# Altium schematic sheet POWER.SchDoc
size A3
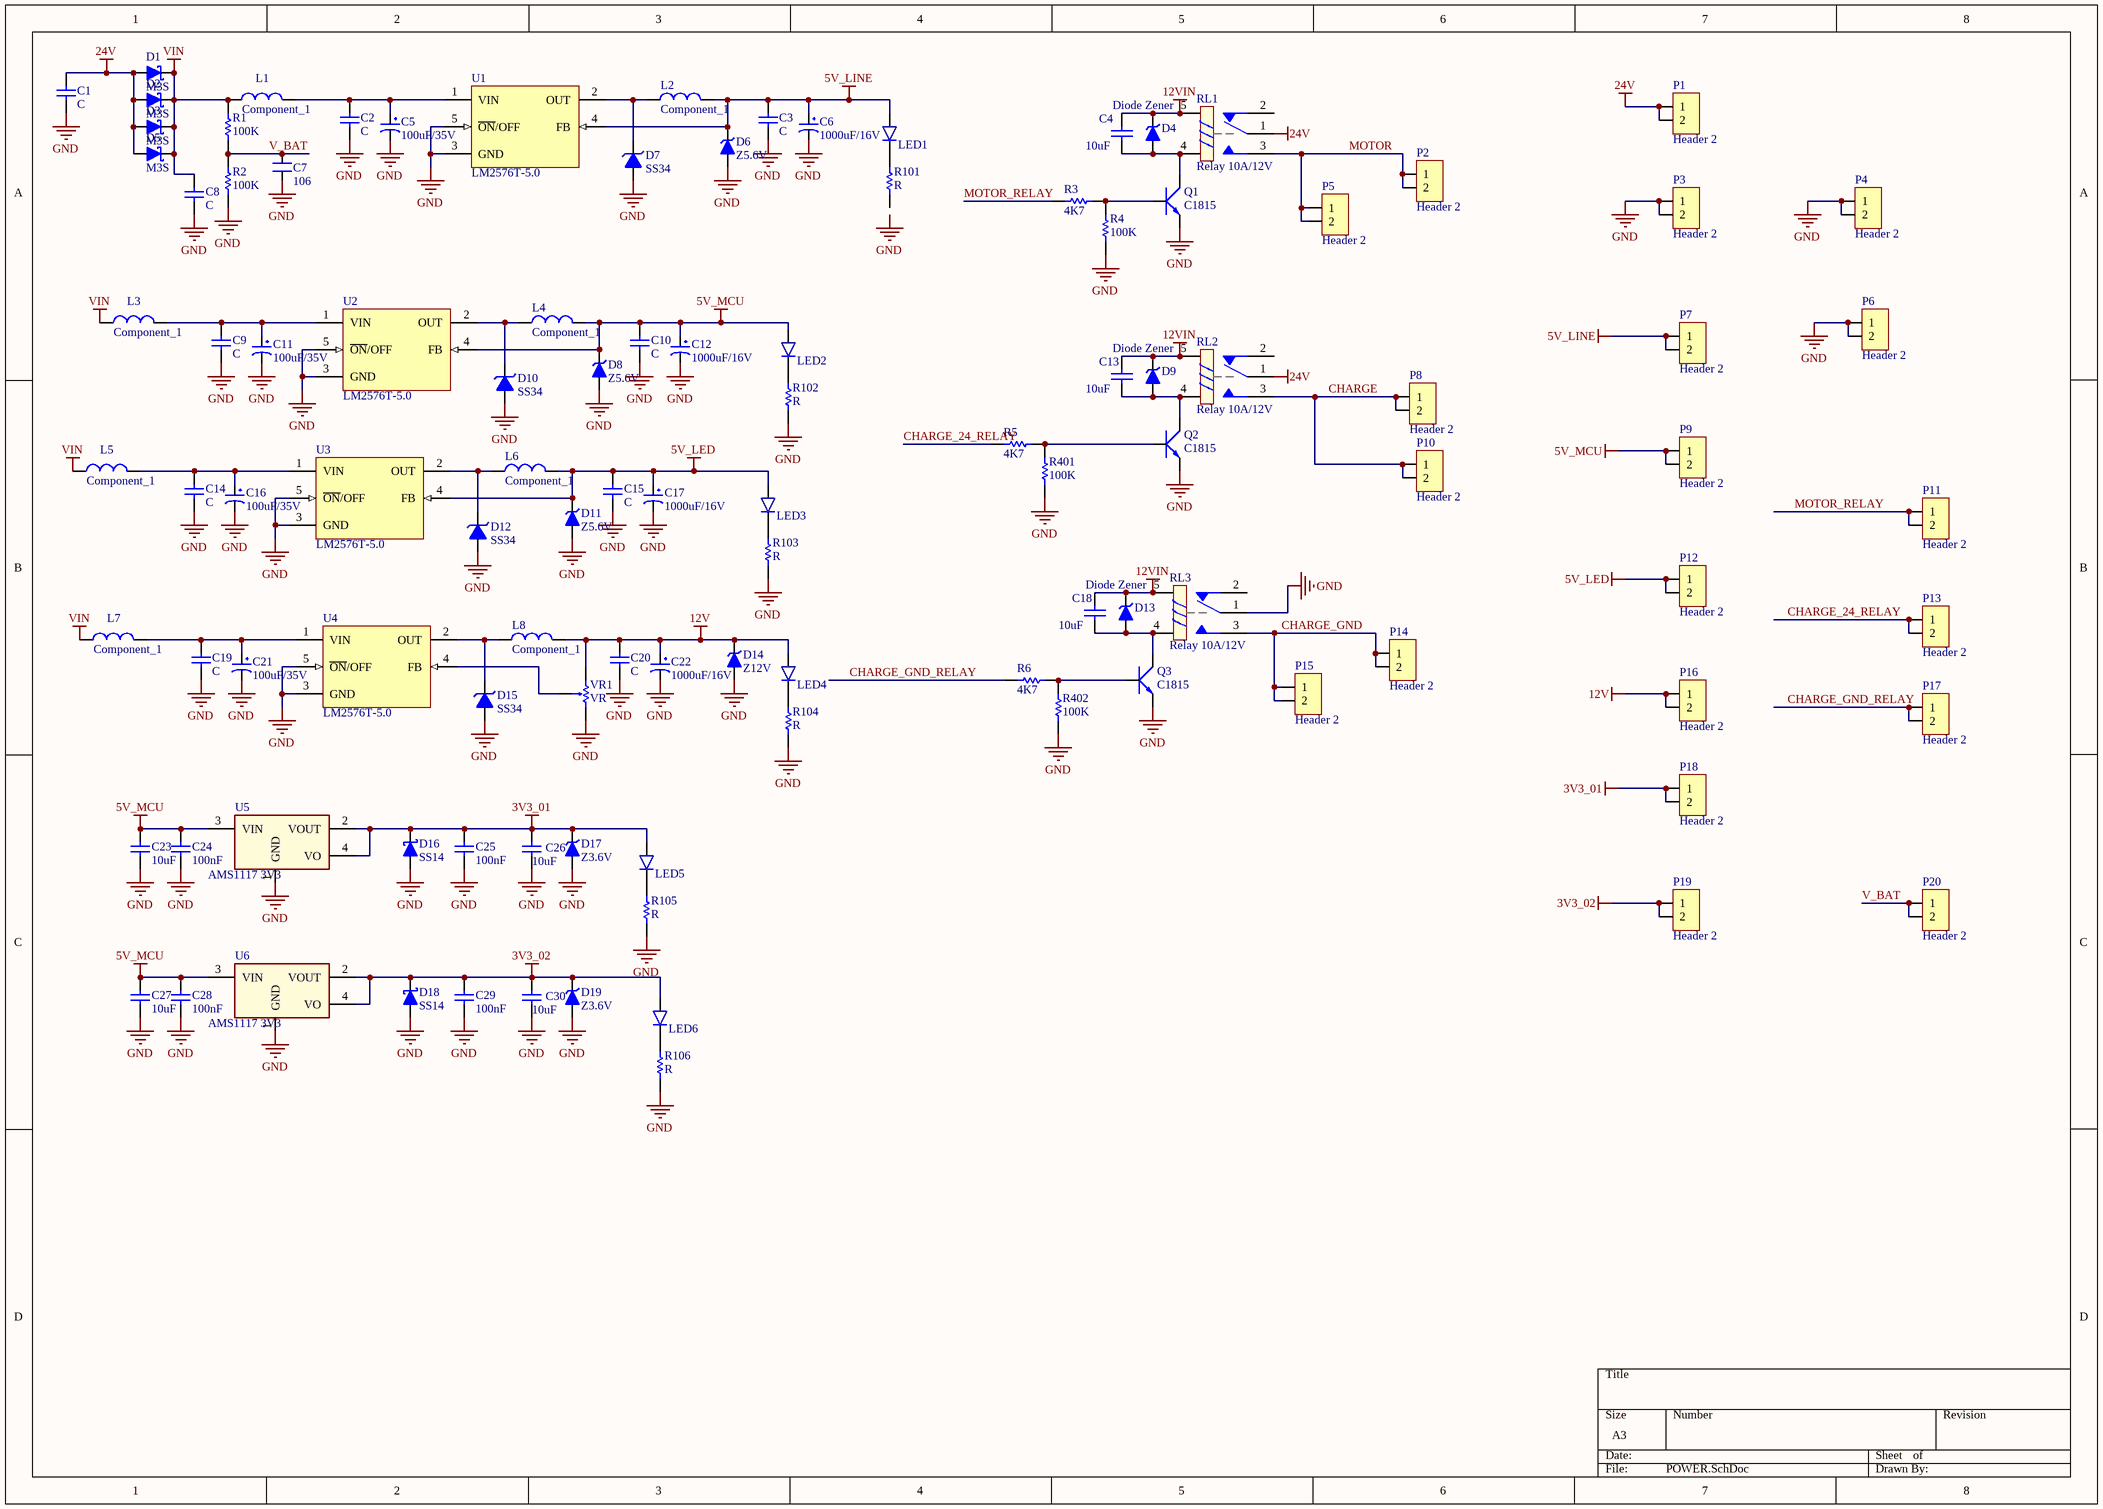
[diagram p0: POWER.SchDoc]

## Parts
C1  C  [VARISTOR DISC 5MM/7MM]
C2  C  [C 104]
C3  C  [C 0805 (2012)]
C4  value 10uF  [C 0805 (2012)]  (hidden comment: Cap Non-pol)
C5  100uF/35V  [WCAP-PSHP 8x8.7x3.1]
C6  1000uF/16V  [WCAP-PSHP 8x8.7x3.1]
C7  106  [R 0805 (2012)]
C8  C  [C 104]
C9  C  [C 104]
C10  C  [C 0805 (2012)]
C11  100uF/35V  [WCAP-PSHP 8x8.7x3.1]
C12  1000uF/16V  [WCAP-PSHP 8x8.7x3.1]
C13  value 10uF  [C 0805 (2012)]  (hidden comment: Cap Non-pol)
C14  C  [C 104]
C15  C  [C 0805 (2012)]
C16  100uF/35V  [WCAP-PSHP 8x8.7x3.1]
C17  1000uF/16V  [WCAP-PSHP 8x8.7x3.1]
C18  value 10uF  [C 0805 (2012)]  (hidden comment: Cap Non-pol)
C19  C  [C 104]
C20  C  [C 0805 (2012)]
C21  100uF/35V  [WCAP-PSHP 8x8.7x3.1]
C22  1000uF/16V  [WCAP-PSHP 8x8.7x3.1]
C23  10uF  [C 0805 (2012)]
C24  100nF  [C 0805 (2012)]
C25  100nF  [C 0805 (2012)]
C26  10uF  [C 0805 (2012)]
C27  10uF  [C 0805 (2012)]
C28  100nF  [C 0805 (2012)]
C29  100nF  [C 0805 (2012)]
C30  10uF  [C 0805 (2012)]
D1  M3S  [DO-214AC (SMA)]
D2  M3S  [DO-214AC (SMA)]
D3  M3S  [DO-214AC (SMA)]
D4  Diode Zener  [SOD-80]
D5  M3S  [DO-214AC (SMA)]
D6  Z5.6V  [SOD-80]
D7  SS34  [DO-214AC (SMA) L]
D8  Z5.6V  [SOD-80]
D9  Diode Zener  [SOD-80]
D10  SS34  [DO-214AC (SMA) L]
D11  Z5.6V  [SOD-80]
D12  SS34  [DO-214AC (SMA) L]
D13  Diode Zener  [SOD-80]
D14  Z12V  [SOD-80]
D15  SS34  [DO-214AC (SMA) L]
D16  SS14  [DO-214AC (SMA)]
D17  Z3.6V  [SOD-80]
D18  SS14  [DO-214AC (SMA)]
D19  Z3.6V  [SOD-80]
L1  Component_1  [1210]
L2  Component_1  [1210]
L3  Component_1  [1210]
L4  Component_1  [1210]
L5  Component_1  [1210]
L6  Component_1  [1210]
L7  Component_1  [1210]
L8  Component_1  [1210]
LED1  Led  [Led SMD 0805]  (value not drawn)
LED2  Led  [Led SMD 0805]  (value not drawn)
LED3  Led  [Led SMD 0805]  (value not drawn)
LED4  Led  [Led SMD 0805]  (value not drawn)
LED5  Led  [Led SMD 0805]  (value not drawn)
LED6  Led  [Led SMD 0805]  (value not drawn)
P1  Header 2  [HDR Domino 2]
P2  Header 2  [HDR Domino 2]
P3  Header 2  [HDR Domino 2]
P4  Header 2  [HDR Domino 2]
P5  Header 2  [HDR Domino 2]
P6  Header 2  [HDR Domino 2]
P7  Header 2  [HDR Domino 2]
P8  Header 2  [HDR Domino 2]
P9  Header 2  [HDR Domino 2]
P10  Header 2  [HDR Domino 2]
P11  Header 2  [HDR Domino 2]
P12  Header 2  [HDR Domino 2]
P13  Header 2  [HDR Domino 2]
P14  Header 2  [HDR Domino 2]
P15  Header 2  [HDR Domino 2]
P16  Header 2  [HDR Domino 2]
P17  Header 2  [HDR Domino 2]
P18  Header 2  [HDR Domino 2]
P19  Header 2  [HDR Domino 2]
P20  Header 2  [HDR Domino 2]
Q1  C1815  [SOT23B]
Q2  C1815  [SOT23B]
Q3  C1815  [SOT23B]
R1  100K  [R 0805 (2012)]
R2  100K  [R 0805 (2012)]
R3  4K7  [R 0805 (2012)]
R4  100K  [R 0805 (2012)]
R5  4K7  [R 0805 (2012)]
R6  4K7  [R 0805 (2012)]
R101  R  [R 0805 (2012)]
R102  R  [R 0805 (2012)]
R103  R  [R 0805 (2012)]
R104  R  [R 0805 (2012)]
R105  R  [R 0805 (2012)]
R106  R  [R 0805 (2012)]
R401  100K  [R 0805 (2012)]
R402  100K  [R 0805 (2012)]
RL1  Relay 10A/12V  [RL_SPDT_10A]
RL2  Relay 10A/12V  [RL_SPDT_10A]
RL3  Relay 10A/12V  [RL_SPDT_10A]
U1  LM2576T-5.0  [D2-PACK5]
U2  LM2576T-5.0  [D2-PACK5]
U3  LM2576T-5.0  [D2-PACK5]
U4  LM2576T-5.0  [D2-PACK5]
U5  AMS1117 3V3  [SOT-223]
U6  AMS1117 3V3  [SOT-223]
VR1  VR  [R VAR E]

## Nets
3V3_01: C25.1 C26.1 D16.2(K) D17.2(K) LED5.1(A) P18.1 P18.2 U5.2(VOUT) U5.4(VO)
3V3_02: C29.1 C30.1 D18.2(K) D19.2(K) LED6.1(A) P19.1 P19.2 U6.2(VOUT) U6.4(VO)
5V_LED: C15.1 C17.1 D11.2(K) L6.2 LED3.1(A) P12.1 P12.2 U3.4(FB)
5V_LINE: C3.1 C6.1 D6.2(K) L2.2 LED1.1(A) P7.1 P7.2 U1.4(FB)
5V_MCU: C10.1 C12.1 C23.1 C24.1 C27.1 C28.1 D8.2(K) L4.2 LED2.1(A) P9.1 P9.2 U2.4(FB) U5.3(VIN) U6.3(VIN)
12V: C20.1 C22.1 D14.2(K) L8.2 LED4.1(A) P16.1 P16.2 VR1.3
12VIN: C4.2 C13.2 C18.2 D4.2(K) D9.2(K) D13.2(K) RL1.5 RL2.5 RL3.5
24V: C1.1 D1.1(A) D2.1(A) D3.1(A) D5.1(A) P1.1 P1.2 RL1.1 RL2.1
GND: C1.2 C2.2 C3.2 C5.2 C6.2 C7.1 C8.2 C9.2 C10.2 C11.2 C12.2 C14.2 C15.2 C16.2 C17.2 C19.2 C20.2 C21.2 C22.2 C23.2 C24.2 C25.2 C26.2 C27.2 C28.2 C29.2 C30.2 D6.1(A) D7.1(A) D8.1(A) D10.1(A) D11.1(A) D12.1(A) D14.1(A) D15.1(A) D16.1(A) D17.1(A) D18.1(A) D19.1(A) P3.1 P3.2 P4.1 P4.2 P6.1 P6.2 Q1.1(E) Q2.1(E) Q3.1(E) R2.2 R4.1 R102.1 R103.1 R104.1 R105.1 R106.1 R401.1 R402.1 RL3.1 U1.3(GND) U1.5(~{ON}/OFF) U2.3(GND) U2.5(~{ON}/OFF) U3.3(GND) U3.5(~{ON}/OFF) U4.3(GND) U4.5(~{ON}/OFF) U5.1(GND) U6.1(GND) VR1.1
VIN: C8.1 D1.2(K) D2.2(K) D3.2(K) D5.2(K) L1.1 L3.1 L5.1 L7.1 R1.1
CHARGE: P8.1 P8.2 P10.1 P10.2 RL2.3
CHARGE_24_RELAY: P13.1 P13.2 R5.1
CHARGE_GND: P14.1 P14.2 P15.1 P15.2 RL3.3
CHARGE_GND_RELAY: P17.1 P17.2 R6.1
MOTOR: P2.1 P2.2 P5.1 P5.2 RL1.3
MOTOR_RELAY: P11.1 P11.2 R3.1
V_BAT: C7.2 P20.1 P20.2 R1.2 R2.1
NetC2_1: C2.1 C5.1 L1.2 U1.1(VIN)
NetC4_1: C4.1 D4.1(A) Q1.2(C) RL1.4
NetC9_1: C9.1 C11.1 L3.2 U2.1(VIN)
NetC13_1: C13.1 D9.1(A) Q2.2(C) RL2.4
NetC14_1: C14.1 C16.1 L5.2 U3.1(VIN)
NetC18_1: C18.1 D13.1(A) Q3.2(C) RL3.4
NetC19_1: C19.1 C21.1 L7.2 U4.1(VIN)
NetD7_2: D7.2(K) L2.1 U1.2(OUT)
NetD10_2: D10.2(K) L4.1 U2.2(OUT)
NetD12_2: D12.2(K) L6.1 U3.2(OUT)
NetD15_2: D15.2(K) L8.1 U4.2(OUT)
NetLED1_2: LED1.2(K) R101.2
NetLED2_2: LED2.2(K) R102.2
NetLED3_2: LED3.2(K) R103.2
NetLED4_2: LED4.2(K) R104.2
NetLED5_2: LED5.2(K) R105.2
NetLED6_2: LED6.2(K) R106.2
NetQ1_3: Q1.3(B) R3.2 R4.2
NetQ2_3: Q2.3(B) R5.2 R401.2
NetQ3_3: Q3.3(B) R6.2 R402.2
NetU4_4: U4.4(FB) VR1.2

Not connected (* = marked no-connect by the designer): R101 1; RL1 2; RL2 2; RL3 2

## Notes on the sheet
- Labels drawn without touching a wire or pin: GND

## Library data of the parts
C1-C3 C8-C10 C14 C15 C19 C20 C23-C30 = Capacitor NP: Capacitor non-pol
C4 C13 C18 = Cap Non-pol: Non-polarized Capacitor; Published: 8-Jun-2000; LatestRevisionDate: 17-Jul-2002; LatestRevisionNote: Re-released for DXP Platform.; PackageReference: RAD-0.3; Publisher: Altium Limited
C5 C11 C16 C21 = CP3: Cap 100uF/35V - 470uF/16V; Value: 100uF/35V/50V; Description 1: 1000uF/6,3V - 470uF/16V - 330uF - 25V; Description 2: 220uF/35V - 100uF/50V - 63V - 4,7uF/200V; Description 3: 22uF => 33uF100V - 3,3uF => 4,7uF/250V; Description 4: 2,2uF =>3,3uF/350 - 2,2uF/400V - 1uF/450V
C6 C12 C17 C22 = CP4: Cap 1000uF/16V - 220uF/50V; Description 5: 4,7uF>10uF/250V_3,3uF>10uF/400V - 2,2uF>4,7uF/450V; Description 1: 2200uF-3300uF/6,3V - 1000uF-2200uF/10V; Description 2: 1000uF/16V - 470uF => 1000uF/25V - 100uF/100V; Description 3: 330uF>470uF/35V_220uF>470uF/50V_10uF>22uF/250V; Description 4: 220uF => 330uF/63V - 10uF =>33uF/160 - 200V; Value: 1000uF/16V
C7 = CN2: Cap np 104 => 105pF; Value: 0.1uF
D1-D3 D5 D16 D18 = Diode Schottky: Schottky Diode; Published: 8-Jun-2000; LatestRevisionDate: 17-Jul-2002; LatestRevisionNote: Re-released for DXP Platform.; PackageReference: SMB; Publisher: Altium Limited; Code_JEDEC: DO-214-AA
D4 D6 D8 D9 D11 D13 D14 D17 D19 = Diode Zener: Zener Diode; Published: 8-Jun-2000; LatestRevisionDate: 17-Jul-2002; LatestRevisionNote: Re-released for DXP Platform.; PackageReference: DIODE-0.7; Publisher: Altium Limited
D7 D10 D12 D15 = Zener
LED1-LED6 = Led: Typical LED
P1-P20 = Header 2: Header, 2-Pin; LatestRevisionDate: 17-Jul-2002; LatestRevisionNote: Re-released for DXP Platform.; Publisher: Altium Limited
Q1-Q3 = C1815: NPN 600mW, ECB; Value: C1815
R1-R6 R101-R106 R401 R402 = Resistor: Published: 8-Jun-2000; LatestRevisionDate: 17-Jul-2002; LatestRevisionNote: Re-released for DXP Platform.; PackageReference: AXIAL-0.3; Publisher: Altium Limited
RL1-RL3 = Relay 1: Relay SPDT,10A - 12VDC 5 Pin; Value: Relay SPDT, 10A, 12V
U1-U4 = LM2576T-5.0: SIMPLE SWITCHER; 3A Step-Down Voltage Regulator; Manufacturer: National Semiconductor; PackageTopMarking: NSUZXYTT*LM2576T*-5.0 P+; PowerWise: N; FirstPublished: 4-Dec-2008; DatasheetVersion: Aug-2004; PackageVersion: revJ, Jan-1992; PackageReference: T05A; Publisher: Altium Limited; PackageDescription: TO-220, Molded, 5 Lead, Straight; CompType: Switcher; PartNumber: LM2576T-5.0; RoHS: O; PinCount: 5; DigiKeyPartNumber: LM2576T-5.0-ND; Code_JEDEC: TO-220-AB; ComponentLink1Description: LM2576 Datasheet; ComponentLink1URL: http://www.national.com/ds/LM/LM2576.pdf; ComponentLink2Description: LM2576 Web Page; ComponentLink2URL: http://www.national.com/pf/LM/LM2576.html; ComponentLink3Description: T05A Package Page; ComponentLink3URL: http://www.national.com/packaging/folders/t05a.html
U5 U6 = AMS1117: 1A LDO Voltage Regulator, ADJ or fixed 1.5/1.8/2.5/2.85/3.3/5V
VR1 = Resistor Variable